# Altium project sensor.PrjPCB
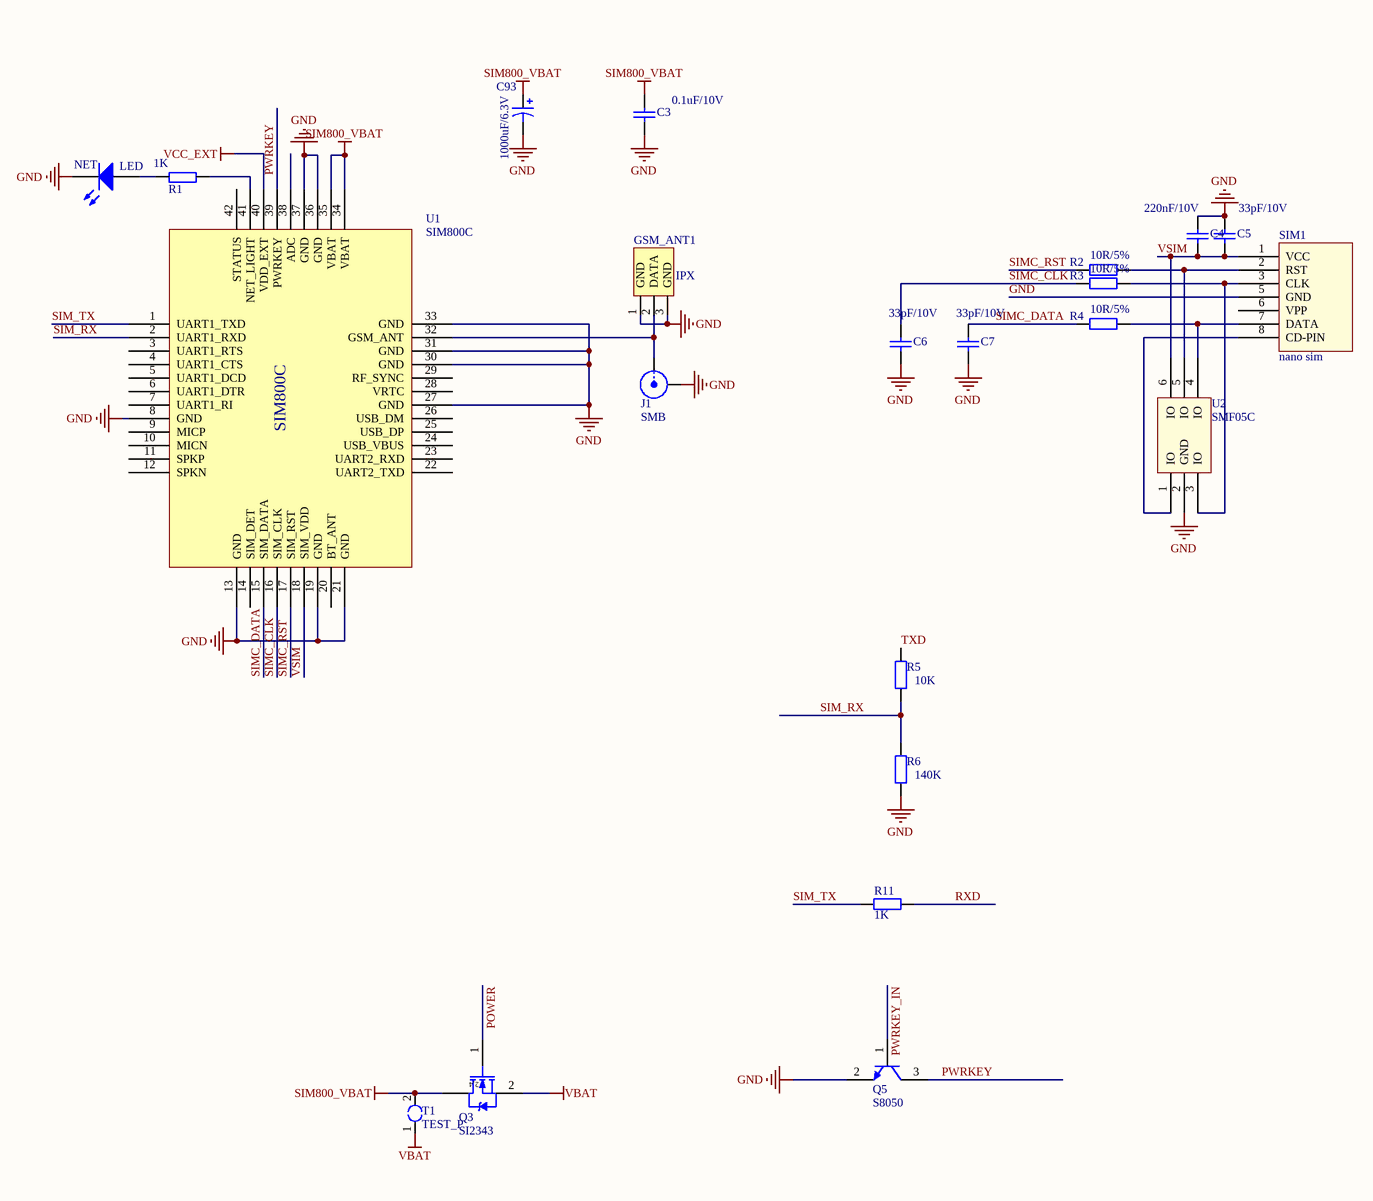
[diagram p0: GPRS.SchDoc]
3 sheets, 70 parts. Net scope: global (net labels, ports and power ports of the same name join across sheets).
Board file: PCB1.PcbDoc
Sheets:
  GPRS.SchDoc
  MCU.SchDoc
  power.SchDoc

## Sheet GPRS.SchDoc
size A3

### Parts
C3  0.1uF/10V  [0603C]
C4  220nF/10V  [0603C]
C5  33pF/10V  [0603C]
C6  33pF/10V  [0603C]
C7  33pF/10V  [0603C]
C93  1000uF/6.3V  [7343]
GSM_ANT1  IPX  [IPX]
J1  SMB  [SMA END LAUNCH JACK RECEPTACLE SHORT]
NET  LED  [0603LED]
Q3  SI2343  [SOT23-3]
Q5  S8050  [SOT23-3]
R1  1K  [0603r]
R2  10R/5%  [0603R]
R3  10R/5%  [0603R]
R4  10R/5%  [0603R]
R5  10K  [0603R]
R6  140K  [0603R]
R11  1K  [0603R]
SIM1  nano sim  [Nano SIM]
T1  TEST_P  [TEST_P]
U1  SIM800C  [SIM800C]
U2  SMF05C  [SC70-6L]

### Nets
GND: C3.2 C4.1 C5.1 C6.2 C7.2 C93.2 GSM_ANT1.1(GND) GSM_ANT1.3(GND) J1.2(Y) NET.2(K) Q5.2(E) R6.2 SIM1.5(GND) U1.8(GND) U1.13(GND) U1.19(GND) U1.21(GND) U1.27(GND) U1.30(GND) U1.31(GND) U1.33(GND) U1.36(GND) U1.37(GND) U2.2(GND)
SIM800_VBAT: C3.1 C93.1 Q3.3(D) T1.2 U1.34(VBAT) U1.35(VBAT)
VBAT: Q3.2(S) T1.1
VCC_EXT: U1.40(VDD_EXT)
POWER: Q3.1(G)
PWRKEY: Q5.3(C) U1.39(PWRKEY)
PWRKEY_IN: Q5.1(B)
RXD: R11.2
SIM_RX: R5.2 R6.1 U1.2(UART1_RXD)
SIM_TX: R11.1 U1.1(UART1_TXD)
SIMC_CLK: C6.1 R3.2 U1.16(SIM_CLK)
SIMC_DATA: C7.1 R4.2 U1.15(SIM_DATA)
SIMC_RST: R2.2 U1.17(SIM_RST)
TXD: R5.1
VSIM: C4.2 C5.2 SIM1.1(VCC) U1.18(SIM_VDD) U2.6(IO)
NetGSM_ANT1_2: GSM_ANT1.2(DATA) J1.1(X) U1.32(GSM_ANT)
NetNET_1: NET.1(A) R1.1
NetR1_2: R1.2 U1.41(NET_LIGHT)
NetR2_1: R2.1 SIM1.2(RST) U2.5(IO)
NetR3_1: R3.1 SIM1.3(CLK) U2.3(IO)
NetR4_1: R4.1 SIM1.7(DATA) U2.4(IO)
NetSIM1_8: SIM1.8(CD-PIN) U2.1(IO)

Not connected (* = marked no-connect by the designer): SIM1 6(VPP); U1 3(UART1_RTS) 4(UART1_CTS) 5(UART1_DCD) 6(UART1_DTR) 7(UART1_RI) 9(MICP) 10(MICN) 11(SPKP) 12(SPKN) 14(SIM_DET) 20(BT_ANT) 22(UART2_TXD) 23(UART2_RXD) 24(USB_VBUS) 25(USB_DP) 26(USB_DM) 28(VRTC) 29(RF_SYNC) 38(ADC) 42(STATUS)

### Notes on the sheet
- (in symbol BUK92150-55A) 2,4

### Library data of the parts
C3 = Cap: Capacitor; Published: 8-Jun-2000; LatestRevisionDate: 17-Jul-2002; LatestRevisionNote: Re-released for DXP Platform.; PackageReference: RAD-0.3; Publisher: Altium Limited; Value: 0.1uF/10V
C4-C7 = Cap: Capacitor; Value: 0.1uF/10V; Published: 8-Jun-2000; LatestRevisionDate: 17-Jul-2002; LatestRevisionNote: Re-released for DXP Platform.; PackageReference: RAD-0.3; Publisher: Altium Limited
C93 = Cap Pol1: Polarized Capacitor (Radial); Published: 8-Jun-2000; LatestRevisionDate: 17-Jul-2002; LatestRevisionNote: Re-released for DXP Platform.; PackageReference: RB7.6-15; Publisher: Altium Limited
GSM_ANT1 = IPEX: IPEX座
J1 = SMB: SMB Straight Connector; LatestRevisionDate: 17-Jul-2002; LatestRevisionNote: Re-released for DXP Platform.; Publisher: Altium Limited
NET = LED2: Typical RED, GREEN, YELLOW, AMBER GaAs LED; Published: 8-Jun-2000; LatestRevisionDate: 17-Jul-2002; LatestRevisionNote: Re-released for DXP Platform.; PackageDocument: Feb-2002; PackageReference: 3.2X1.6X1.1; Publisher: Altium Limited
Q3 = BUK92150-55A: Published: 8-Jun-2000; LatestRevisionDate: 17-Jul-2002; LatestRevisionNote: Re-released for DXP Platform.; DatasheetVersion: 6-Oct-1997; PackageVersion: Aug-1998; PackageReference: TSOP-6; Publisher: Altium Limited; PackageDescription: SOT-457/SC-74; 6 Leads; Body 3.1 x 3 mm, inc. leads (LxW max); ComponentLink1Description: Manufacturer Link; ComponentLink1URL: http://www.vishay.com/; ComponentLink2Description: Datasheet; ComponentLink2URL: http://www.vishay.com/docs/70192/70192.pdf
Q5 = NPN
R1 = R
R2-R4 = Res2: Resistor; Value: 10R; Published: 8-Jun-2000; LatestRevisionDate: 17-Jul-2002; LatestRevisionNote: Re-released for DXP Platform.; PackageReference: AXIAL-0.4; Publisher: Altium Limited
R5 R6 R11 = Res2: Resistor; Value: 0; Published: 8-Jun-2000; LatestRevisionDate: 17-Jul-2002; LatestRevisionNote: Re-released for DXP Platform.; PackageReference: AXIAL-0.4; Publisher: Altium Limited

## Sheet MCU.SchDoc
size A4
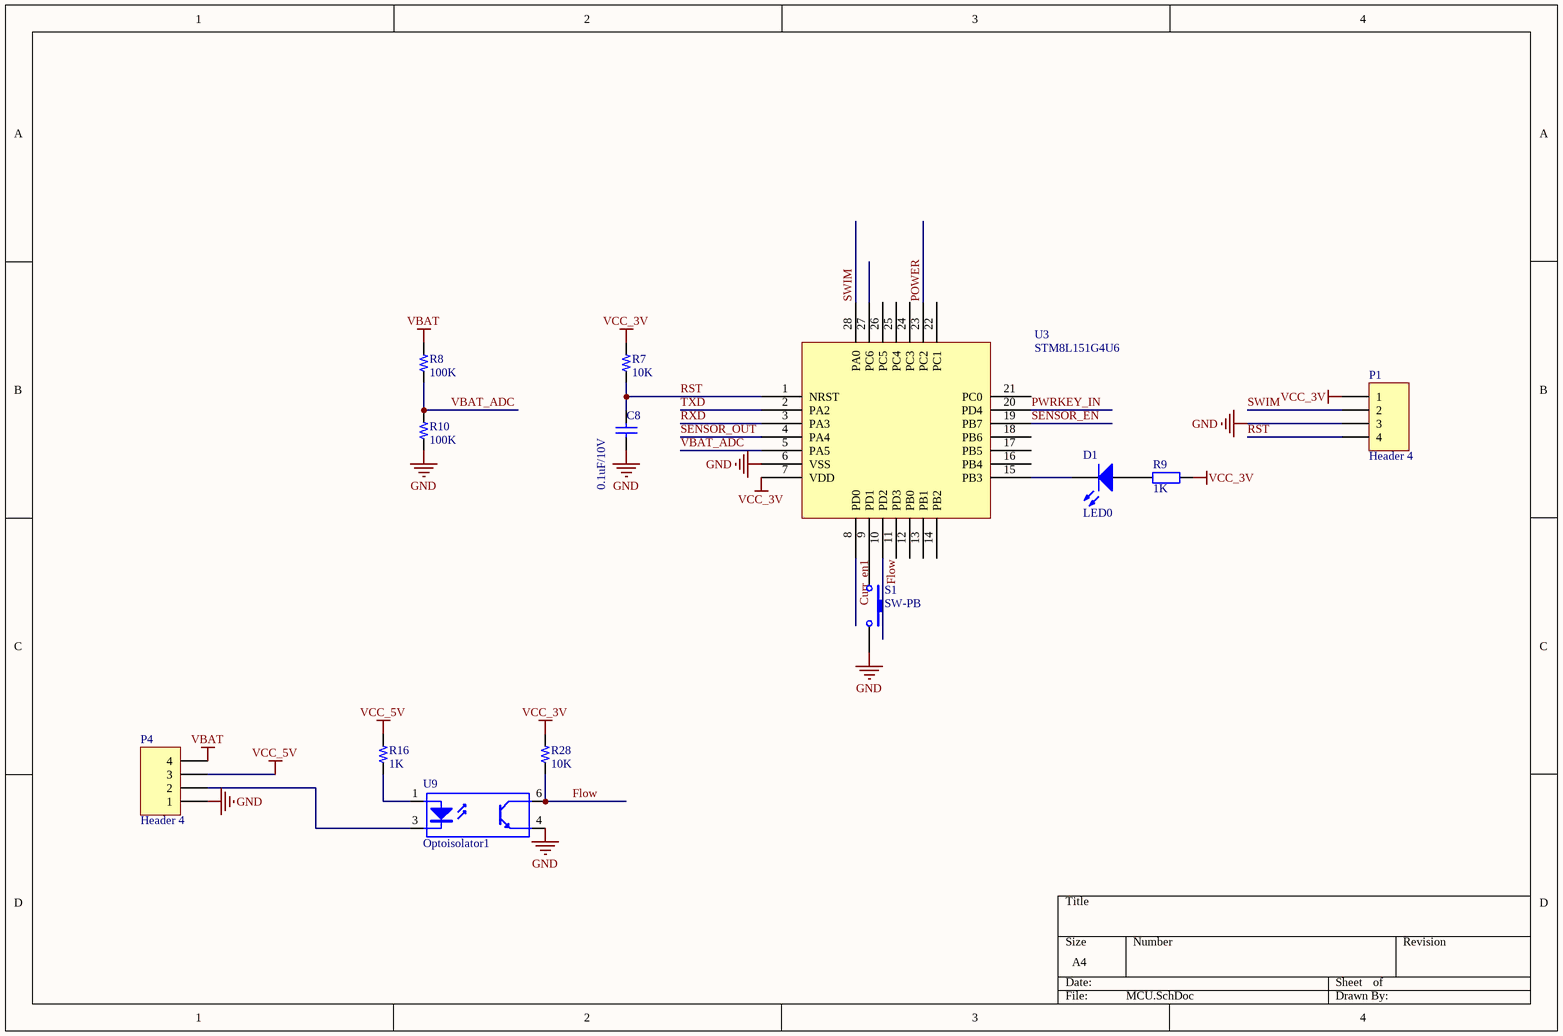
[diagram p1: MCU.SchDoc]

### Parts
C8  0.1uF/10V  [0603C]
D1  LED0  [0603LED]
P1  Header 4  [HDR1X4]
P4  Header 4  [HDR1X4]
R7  10K  [0603R]
R8  100K  [0603R]
R9  1K  [0603R]
R10  100K  [0603R]
R16  1K  [0603R]
R28  10K  [0603R]
S1  SW-PB  [key]
U3  STM8L151G4U6  [UFQFPN28]
U9  Optoisolator1  [DIP-4]

### Nets
GND: C8.2 P1.3 P4.1 R10.1 S1.2 U3.6(VSS) U9.4(E)
VBAT: P4.4 R8.2
VCC_3V: P1.1 R7.2 R9.1 R28.2 U3.7(VDD)
VCC_5V: P4.3 R16.2
Curr_en1: U3.8(PD0)
Flow: R28.1 U3.10(PD2) U9.6(C)
POWER: U3.23(PC2)
PWRKEY_IN: U3.20(PD4)
RST: C8.1 P1.4 R7.1 U3.1(NRST)
RXD: U3.3(PA3)
SENSOR_EN: U3.19(PB7)
SENSOR_OUT: U3.4(PA4)
SWIM: P1.2 U3.28(PA0)
TXD: U3.2(PA2)
VBAT_ADC: R8.1 R10.2 U3.5(PA5)
NetD1_1: D1.1(A) R9.2
NetD1_2: D1.2(K) U3.15(PB3)
NetP4_2: P4.2 U9.3(K)
NetR16_1: R16.1 U9.1(A)
NetS1_1: S1.1 U3.9(PD1)

Not connected (* = marked no-connect by the designer): U3 11(PD3) 12(PB0) 13(PB1) 14(PB2) 16(PB4) 17(PB5) 18(PB6) 21(PC0) 22(PC1) 24(PC3) 25(PC4) 26(PC5) 27(PC6)

### Library data of the parts
C8 = Cap: Capacitor; Value: 104; Published: 8-Jun-2000; LatestRevisionDate: 17-Jul-2002; LatestRevisionNote: Re-released for DXP Platform.; PackageReference: RAD-0.3; Publisher: Altium Limited
D1 = LED0: Typical INFRARED GaAs LED; Published: 8-Jun-2000; LatestRevisionDate: 08-Jul-2005; LatestRevisionNote: Mech Layer 1 removed.; PackageReference: LED-0; Publisher: Altium Limited
P1 P4 = Header 4: Header, 4-Pin; LatestRevisionDate: 17-Jul-2002; LatestRevisionNote: Re-released for DXP Platform.; Publisher: Altium Limited
R7 R8 R10 R16 R28 = R
R9 = Res2: Resistor; Published: 8-Jun-2000; LatestRevisionDate: 17-Jul-2002; LatestRevisionNote: Re-released for DXP Platform.; PackageReference: AXIAL-0.4; Publisher: Altium Limited; Value: 1K
S1 = SW-PB: Switch; Published: 24-Mar-1999; LatestRevisionDate: 17-Jul-2002; LatestRevisionNote: Re-released for DXP Platform.; PackageReference: SPST-2; Publisher: Altium Limited
U9 = Optoisolator1: 4-Pin Phototransistor Optocoupler; Published: 24-Mar-1999; LatestRevisionDate: 04-Mar-2005; LatestRevisionNote: Sch pins 3 & 4 Swapped.; DatasheetVersion: Nov-2003; PackageReference: DIP-4; Publisher: Altium Limited

## Sheet power.SchDoc
size A3
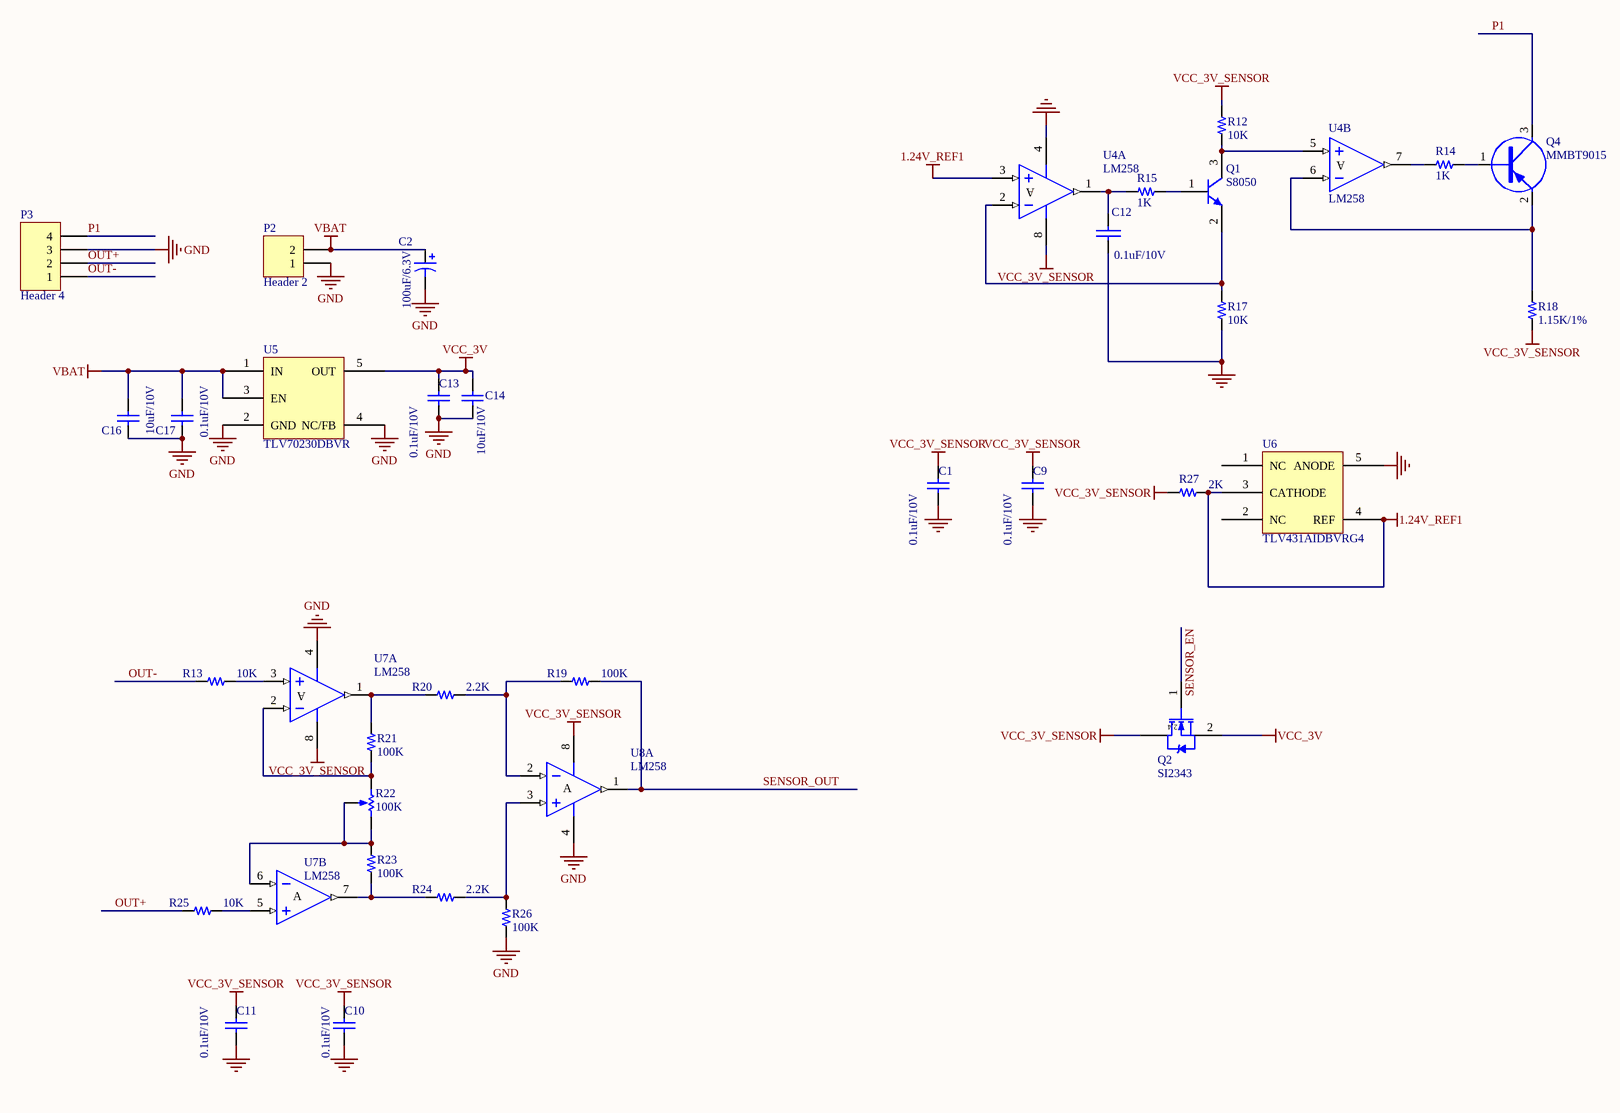
[diagram p2: power.SchDoc]

### Parts
C1  0.1uF/10V  [0603C]
C2  100uF/6.3V  [7343]
C9  0.1uF/10V  [0603C]
C10  0.1uF/10V  [0603C]
C11  0.1uF/10V  [0603C]
C12  0.1uF/10V  [0603C]
C13  0.1uF/10V  [0603C]
C14  10uF/10V  [0603C]
C16  10uF/10V  [0603C]
C17  0.1uF/10V  [0603C]
P2  Header 2  [2X2.54MM]
P3  Header 4  [HDR1X4]
Q1  S8050  [SOT23-3]
Q2  SI2343  [SOT23-3]
Q4  MMBT9015  [SOT23-3]
R12  10K  [0603R]
R13  10K  [0603R]
R14  1K  [0603R]
R15  1K  [0603R]
R17  10K  [0603R]
R18  1.15K/1%  [0603R]
R19  100K  [0603R]
R20  2.2K  [0603R]
R21  100K  [0603R]
R22  100K  [HDR1X3]
R23  100K  [0603R]
R24  2.2K  [0603R]
R25  10K  [0603R]
R26  100K  [0603R]
R27  2K  [0603R]
U4  LM258  [so-8]  (parts A,B of 2)
U5  TLV70230DBVR  [SOT23-5(DBV)]
U6  TLV431AIDBVRG4  [SOT23-5(DBV)]
U7  LM258  [so-8]  (parts A,B of 2)
U8  LM258  [so-8]  (part A of 2)

### Nets
1.24V_REF1: R27.2 U4.3(IN+) U6.3(CATHODE) U6.4(REF)
GND: C1.2 C2.2 C9.2 C10.2 C11.2 C12.2 C13.2 C14.1 C16.1 C17.2 P2.1 P3.3 R17.1 R26.1 U4.4(V-) U5.2(GND) U5.4(NC/FB) U6.5(ANODE) U7.4(V-) U8.4(V-)
VBAT: C2.1 C16.2 C17.1 P2.2 U5.1(IN) U5.3(EN)
VCC_3V: C13.1 C14.2 Q2.2(S) U5.5(OUT)
VCC_3V_SENSOR: C1.1 C9.1 C10.1 C11.1 Q2.3(D) R12.2 R18.1 R27.1 U4.8(V+) U7.8(V+) U8.8(V+)
OUT+: P3.2 R25.1
OUT-: P3.1 R13.1
P1: P3.4 Q4.3(C)
SENSOR_EN: Q2.1(G)
SENSOR_OUT: R19.2 U8.1(OUT)
NetC12_1: C12.1 R15.1 U4.1(OUT)
NetQ1_1: Q1.1(B) R15.2
NetQ1_2: Q1.2(E) R17.2 U4.2(IN-)
NetQ1_3: Q1.3(C) R12.1 U4.5(IN+)
NetQ4_1: Q4.1(B) R14.2
NetQ4_2: Q4.2(E) R18.2 U4.6(IN-)
NetR13_2: R13.2 U7.3(IN+)
NetR14_1: R14.1 U4.7(OUT)
NetR19_1: R19.1 R20.2 U8.2(IN-)
NetR20_1: R20.1 R21.2 U7.1(OUT)
NetR21_1: R21.1 R22.1(TOP) U7.2(IN-)
NetR22_2: R22.2(BOT) R22.3(TAP) R23.2 U7.6(IN-)
NetR23_1: R23.1 R24.1 U7.7(OUT)
NetR24_2: R24.2 R26.2 U8.3(IN+)
NetR25_2: R25.2 U7.5(IN+)

Not connected (* = marked no-connect by the designer): U6 1(NC) 2(NC)

### Notes on the sheet
- (in symbol BUK92150-55A) 2,4
- (in symbol LM258, part A) A
- (in symbol LM258, part B) A

### Library data of the parts
C1 C9-C11 C13 C17 = Cap: Capacitor; Value: 104; Published: 8-Jun-2000; LatestRevisionDate: 17-Jul-2002; LatestRevisionNote: Re-released for DXP Platform.; PackageReference: RAD-0.3; Publisher: Altium Limited
C2 = Cap Pol1: Polarized Capacitor (Radial); Published: 8-Jun-2000; LatestRevisionDate: 17-Jul-2002; LatestRevisionNote: Re-released for DXP Platform.; PackageReference: RB7.6-15; Publisher: Altium Limited
C12 = CAP: Capacitor
C14 = Cap: Capacitor; Published: 8-Jun-2000; LatestRevisionDate: 17-Jul-2002; LatestRevisionNote: Re-released for DXP Platform.; PackageReference: RAD-0.3; Publisher: Altium Limited; Value: 10uF/10V
C16 = Cap: Capacitor; Value: 106/50V; Published: 8-Jun-2000; LatestRevisionDate: 17-Jul-2002; LatestRevisionNote: Re-released for DXP Platform.; PackageReference: RAD-0.3; Publisher: Altium Limited
P2 = Header 2: Header, 2-Pin; LatestRevisionDate: 17-Jul-2002; LatestRevisionNote: Re-released for DXP Platform.; Publisher: Altium Limited
P3 = Header 4: Header, 4-Pin; LatestRevisionDate: 17-Jul-2002; LatestRevisionNote: Re-released for DXP Platform.; Publisher: Altium Limited
Q1 = NPN
Q2 = BUK92150-55A: Published: 8-Jun-2000; LatestRevisionDate: 17-Jul-2002; LatestRevisionNote: Re-released for DXP Platform.; DatasheetVersion: 6-Oct-1997; PackageVersion: Aug-1998; PackageReference: TSOP-6; Publisher: Altium Limited; PackageDescription: SOT-457/SC-74; 6 Leads; Body 3.1 x 3 mm, inc. leads (LxW max); ComponentLink1Description: Manufacturer Link; ComponentLink1URL: http://www.vishay.com/; ComponentLink2Description: Datasheet; ComponentLink2URL: http://www.vishay.com/docs/70192/70192.pdf
Q4 = PNP
R12-R15 R17-R21 R23-R27 = R
R22 = RPot: Potentiometer; Sim Note: Enter the Resistance value and the set point into parameter fields.; Set Position: 0.5; Value: 1K; Published: 8-Jun-2000; LatestRevisionDate: 17-Jul-2002; LatestRevisionNote: Re-released for DXP Platform.; PackageReference: VR5; Publisher: Altium Limited
U6 = TPS76318

## Nets that join several sheets
GND: GPRS (24 pins), MCU (7 pins), power (20 pins)
VBAT: GPRS (Q3.2 T1.1), MCU (P4.4 R8.2), power (6 pins)
VCC_3V: MCU (5 pins), power (C13.1 C14.2 Q2.2 U5.5)
POWER: GPRS (Q3.1), MCU (U3.23)
PWRKEY_IN: GPRS (Q5.1), MCU (U3.20)
RXD: GPRS (R11.2), MCU (U3.3)
SENSOR_EN: MCU (U3.19), power (Q2.1)
SENSOR_OUT: MCU (U3.4), power (R19.2 U8.1)
TXD: GPRS (R5.1), MCU (U3.2)